# Altium schematic sheet Wifi.SchDoc
size A
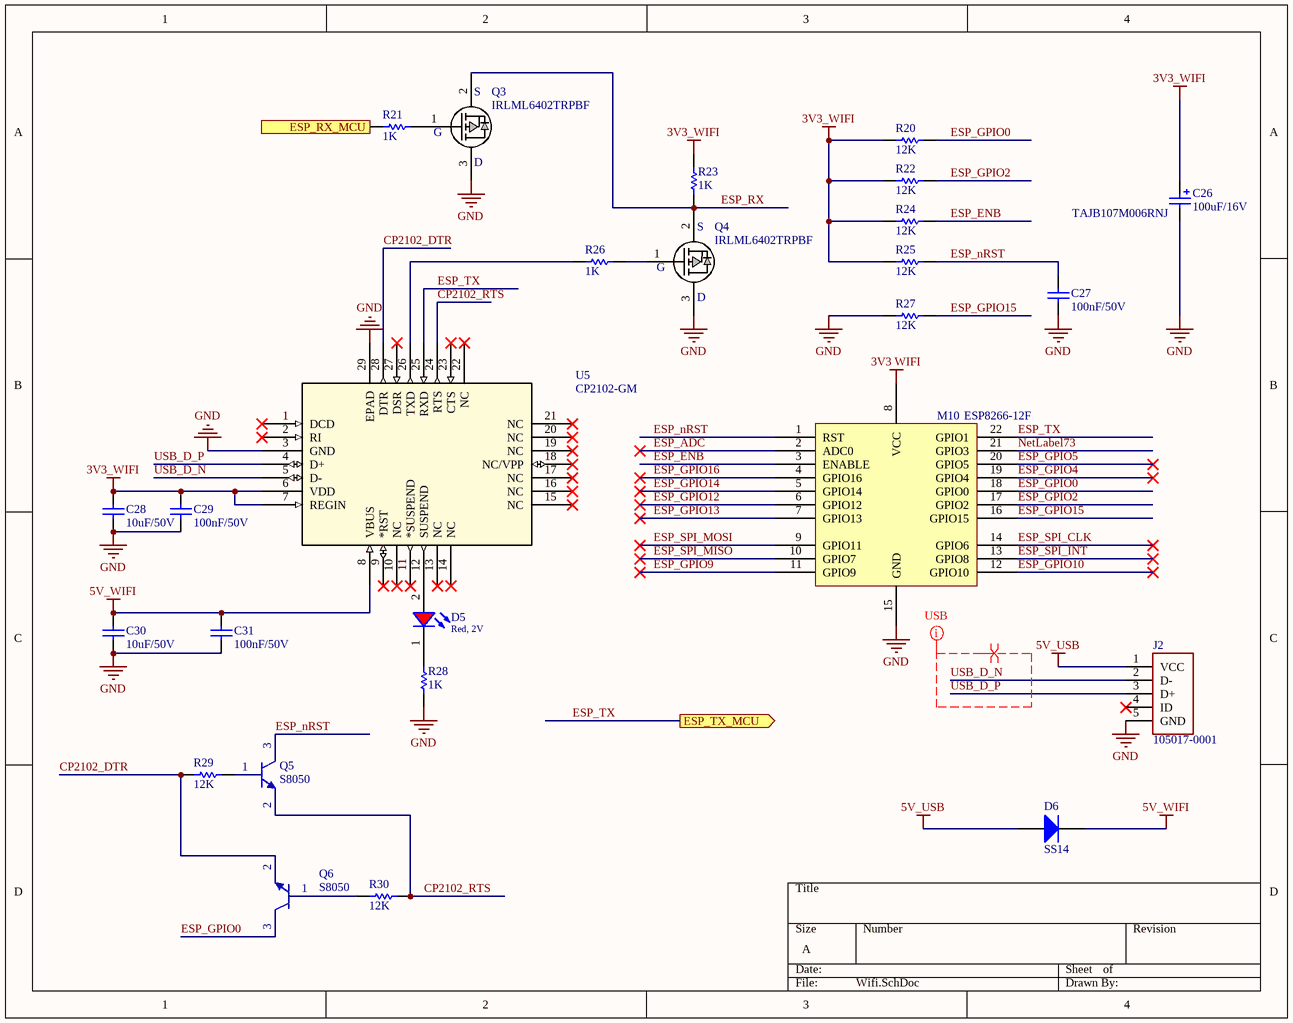
[diagram p0: Wifi.SchDoc]

## Parts
C26  value 100uF/16V  [CAP-SM-AL-SIZE-D-D6L6]  (hidden comment: Cap-Al-100uF-16V-D6L5)
C27  value 100nF/50V  [CAP-SM-0805]  (hidden comment: Cap-100nF-50V-0805)
C28  value 10uF/50V  [CAP-SM-0805]  (hidden comment: Cap-10uF-50V-0805)
C29  value 100nF/50V  [CAP-SM-0805]  (hidden comment: Cap-100nF-50V-0805)
C30  value 10uF/50V  [CAP-SM-0805]  (hidden comment: Cap-10uF-50V-0805)
C31  value 100nF/50V  [CAP-SM-0805]  (hidden comment: Cap-100nF-50V-0805)
D5  Red, 2V  [WL-SMCW_0805]
D6  SS14  [SS14]
J2  105017-0001  [CONN_105017-0001]
M10  ESP8266-12F  [ESP8266-12F]
Q3  IRLML6402TRPBF  [SOT23_NEX]
Q4  IRLML6402TRPBF  [SOT23_NEX]
Q5  S8050  [SOT23_NEX]
Q6  S8050  [SOT23_NEX]
R20  value 12K  [RES-SM-0805]  (hidden comment: Res-12K-0805)
R21  value 1K  [RES-SM-0805]  (hidden comment: Res-1K-0805)
R22  value 12K  [RES-SM-0805]  (hidden comment: Res-12K-0805)
R23  value 1K  [RES-SM-0805]  (hidden comment: Res-1K-0805)
R24  value 12K  [RES-SM-0805]  (hidden comment: Res-12K-0805)
R25  value 12K  [RES-SM-0805]  (hidden comment: Res-12K-0805)
R26  value 1K  [RES-SM-0805]  (hidden comment: Res-1K-0805)
R27  value 12K  [RES-SM-0805]  (hidden comment: Res-12K-0805)
R28  value 1K  [RES-SM-0805]  (hidden comment: Res-1K-0805)
R29  value 12K  [RES-SM-0805]  (hidden comment: Res-12K-0805)
R30  value 12K  [RES-SM-0805]  (hidden comment: Res-12K-0805)
U5  CP2102-GM  [CP2102-GM]

## Ports
ESP_RX_MCU (in), ESP_TX_MCU (out)

## Nets
3V3 WIFI: M10.8(VCC)
3V3_WIFI: C26.1 C28.1 C29.2 R20.1 R22.1 R23.2 R24.1 R25.1 U5.6(VDD) U5.7(REGIN)
5V_USB: D6.2(A) J2.1(VCC)
5V_WIFI: C30.2 C31.2 D6.1(K) U5.8(VBUS)
GND: C26.2 C27.1 C28.2 C29.1 C30.1 C31.1 J2.5(GND) M10.15(GND) Q3.3(D) Q4.3(D) R27.1 R28.1 U5.3(GND) U5.29(EPAD)
CP2102_DTR: Q6.2(E) R29.1 U5.28(DTR)
CP2102_RTS: Q5.2(E) R30.2 U5.24(RTS)
ESP_ADC: M10.2(ADC0)
ESP_ENB: M10.3(ENABLE) R24.2
ESP_GPIO0: M10.18(GPIO0) Q6.3(C) R20.2
ESP_GPIO2: M10.17(GPIO2) R22.2
ESP_GPIO4: M10.19(GPIO4)
ESP_GPIO5: M10.20(GPIO5)
ESP_GPIO9: M10.11(GPIO9)
ESP_GPIO10: M10.12(GPIO10)
ESP_GPIO12: M10.6(GPIO12)
ESP_GPIO13: M10.7(GPIO13)
ESP_GPIO14: M10.5(GPIO14)
ESP_GPIO15: M10.16(GPIO15) R27.2
ESP_GPIO16: M10.4(GPIO16)
ESP_nRST: C27.2 M10.1(RST) Q5.3(C) R25.2
ESP_RX: Q3.2(S) Q4.2(S) R23.1
ESP_RX_MCU: R21.1 ; port ESP_RX_MCU
ESP_SPI_CLK: M10.14(GPIO6)
ESP_SPI_INT: M10.13(GPIO8)
ESP_SPI_MISO: M10.10(GPIO7)
ESP_SPI_MOSI: M10.9(GPIO11)
ESP_TX: M10.22(GPIO1) U5.25(RXD) ; port ESP_TX_MCU
NetLabel73: M10.21(GPIO3)
USB_D_N: J2.2(D-) U5.5(D-)
USB_D_P: J2.3(D+) U5.4(D+)
NetD5_1: D5.1(K) R28.2
NetD5_2: D5.2(A) U5.12(SUSPEND)
NetQ3_1: Q3.1(G) R21.2
NetQ4_1: Q4.1(G) R26.1
NetQ5_1: Q5.1(B) R29.2
NetQ6_1: Q6.1(B) R30.1
NetR26_2: R26.2 U5.26(TXD)

Not connected (* = marked no-connect by the designer): J2 4(ID)*; U5 1(DCD)* 2(RI)* 9(*RST)* 10(NC)* 11(*SUSPEND)* 13(NC)* 14(NC)* 15(NC)* 16(NC)* 17(NC)* 18(NC/VPP)* 19(NC)* 20(NC)* 21(NC)* 22(NC)* 23(CTS)* 27(DSR)*

## Layout directives
differential pair: USB_D_N, USB_D_P
mark named USB: USB_D_N, USB_D_P

## Notes on the sheet
- (near C26) TAJB107M006RNJ

## Library data of the parts
C26 = Cap-Al-100uF-16V-D6L5: CAP ALUM 100UF 20% 16V SMD; Manufacturer: Nichicon; Manufacturer Part Number: UWX1C101MCL1GB; Local Supplier: thegioiic; Local Supplier Link: https://thegioiic.com/products/tu-nhom-smd-100uf-16v-d6-3l5-4; Supplier 1: Digikey; Supplier 1 Part Number: 493-2105-1-ND; Supplier 1 Link: https://www.digikey.com/product-detail/en/nichicon/UWX1C101MCL1GB/493-2105-1-ND/590080
C27 C29 C31 = Cap-100nF-50V-0805: CAP CER 0.1UF 50V Y5V 0805; Manufacturer: Samsung Electro-Mechanics; Manufacturer Part Number: CL21F104ZBCNNNC; Local Supplier: thegioiic; Local Supplier Link: https://thegioiic.com/products/tu-100nf-0-1uf-50v-0805; Supplier 1: Digikey; Supplier 1 Part Number: 1276-1007-1-ND; Supplier 1 Link: https://www.digikey.com/product-detail/en/samsung-electro-mechanics/CL21F104ZBCNNNC/1276-1007-1-ND/3889093
C28 C30 = Cap-10uF-50V-0805: CAP CER 10UF 50V X5R 0805; Manufacturer: Yageo; Manufacturer Part Number: CC0805KKX5R9BB106; Local Supplier: thegioiic; Local Supplier Link: https://thegioiic.com/products/tu-10uf-50v-0805; Supplier 1: Digikey; Supplier 1 Link: https://www.digikey.com/product-detail/en/yageo/CC0805KKX5R9BB106/311-3499-2-ND/7164383; Supplier 1 Part Number: 311-3499-2-ND
D5 = 150080RS75000: WL-SMCW SMT Mono-color Chip LED Waterclear, size 0805, Red, 2V, 140deg; Chip Technology: AlInGaP; Dominant Wavelength typ.: 625nm; Luminous Intensity typ.: 150mcd; Peak Wavelength typ.: 630nm; Viewing Angle: 140deg; ComponentLink1Description: Manufacturer; ComponentLink1URL: http://www.we-online.de; ComponentLink2URL: https://www.we-online.com/catalog/datasheet/150080RS75000.pdf; ComponentLink2Description: Datasheet; Forward Voltage typ.: 2V; Emitting Color: Red; Mounting Technology: SMT; Operating Temperature: -40 to +85degC; Published Date: December 2019; Part Number: 150080RS75000; Packaging: Tape and Reel; Size: 0805; Publisher: Wurth Elektronik
D6 = Diode-SS14: DIODE SCHOTTKY 40V 1A SMA; Manufacturer: ON Semiconductor; Local Supplier: thegioiic; Local Supplier Link: https://thegioiic.com/products/ss14-sma; Supplier 1: Digikey; Supplier 1 Link: https://www.digikey.com/product-detail/en/on-semiconductor/SS14/SS14CT-ND/965729; Manufacturer Part Number: SS14; Supplier 1 Part Number: SS14CT-ND
J2 = 105017-0001: No Description Available; Vendor: Molex Connector Corporation; Built_By: EMA_Cory; SourceLibrary: Molex_2020-05-26; Datasheet: https://www.molex.com/pdm_docs/sd/1050170001_sd.pdf; Manufacturer_Part_Number: 105017-0001; Copyright: Copyright (C) 2018 Accelerated Designs. All rights reserved; RefDes: RefDes; Type: DEV
Q3 Q4 = IRLML6402TRPBF: P-Channel 20V 3.7A (Ta) 1.3W (Ta) Surface Mount Micro3™/SOT-23
R20 R22 R24 R25 R27 R29 R30 = Res-12K-0805: RES 12 KOHM JUMPER 0805; Manufacturer: Vishay Thin Film; Manufacturer Part Number: PAT0805E3121BST1; Local Supplier: icdayroi; Local Supplier Link: https://icdayroi.com/dien-tro-12k-0805-1-goi-50-con; Supplier 1: Digikey; Supplier 1 Link: https://www.digikey.com/product-detail/en/vishay-thin-film/PAT0805E3121BST1/PAT0805E3121BST1-ND/2281536; Supplier 1 Part Number: PAT0805E3121BST1-ND
R21 R23 R26 R28 = Res-1K-0805: RES 1K OHM 1% 1/4W 0805; Manufacturer: Stackpole Electronics Inc; Manufacturer Part Number: RNCP0805FTD1K00; Local Supplier: thegioiic; Local Supplier Link: https://thegioiic.com/products/dien-tro-1k-ohm-0805-5; Supplier 1: Digikey; Supplier 1 Link: https://www.digikey.com/product-detail/en/stackpole-electronics-inc/RNCP0805FTD1K00/RNCP0805FTD1K00CT-ND/2240568; Supplier 1 Part Number: RNCP0805FTD1K00CT-ND
U5 = CP2102-GM: Vendor: Silicon Labs; Built_By: EMA_UL_Team; SourceLibrary: Silicon_Labs_2015-03-23; Manufacturer_Part_Number: CP2102-GM; Copyright: Copyright (C) 2018 Accelerated Designs. All rights reserved; RefDes: RefDes; Type: DEV
M10 = ESP8266-12F: Local Supplier: HShop; Local Supplier Link: https://hshop.vn/products/mach-thu-phat-wifi-soc-esp8266-v12; Local Supplier Link Part Number: HS000912; Manufacturer: *; Manufacturer Part Number: *